# EAGLE design preprocessor (EAGLE 7.7.0)
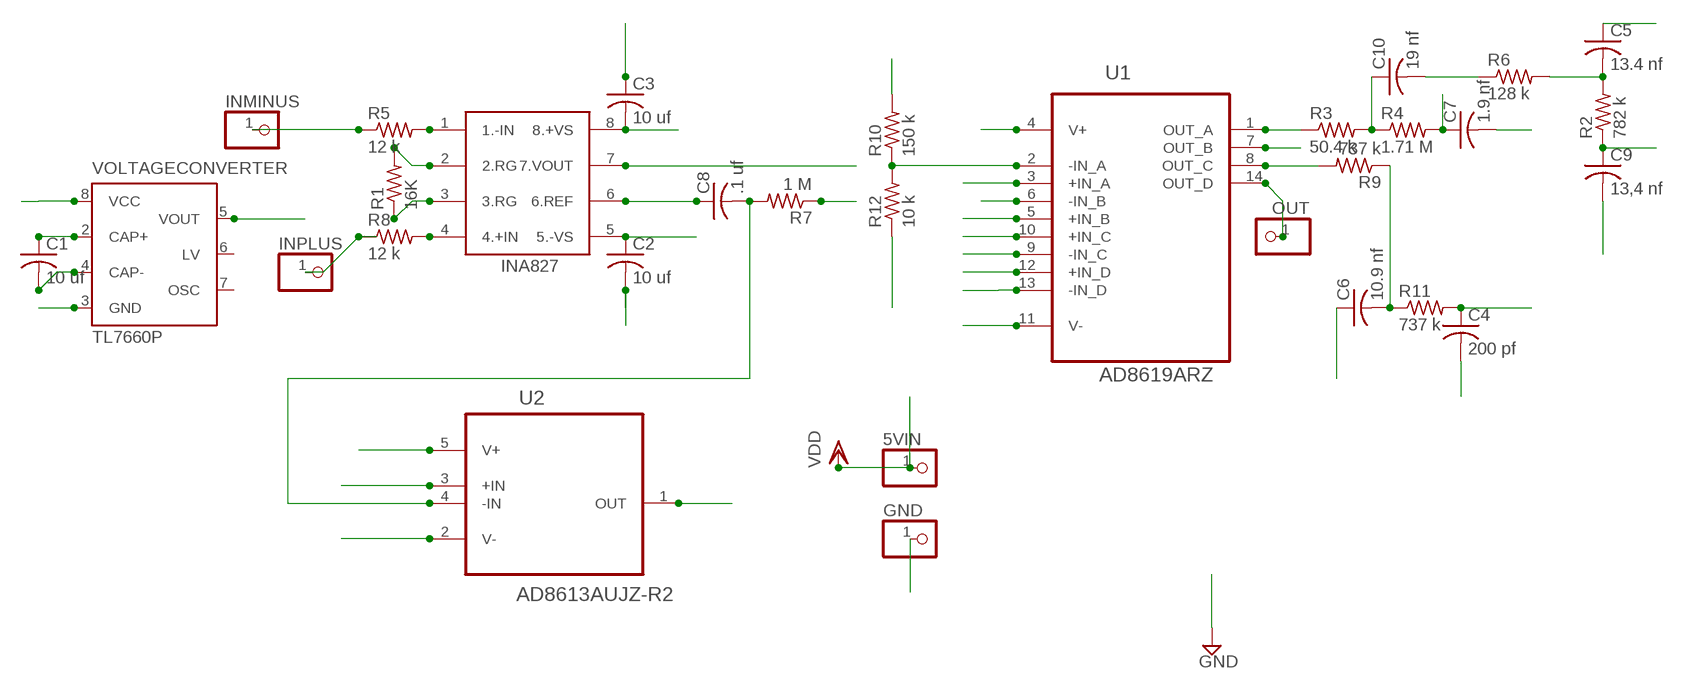
[diagram p0: schematic, sheet 1]

## Parts
5VIN  PINHD-1X1  [1X01]
C1  10 uf  C-US025-025X050  [C025-025X050]
C2  10 uf  C-US025-025X050  [C025-025X050]
C3  10 uf  C-US025-025X050  [C025-025X050]
C4  200 pf  C-US025-025X050  [C025-025X050]
C5  13.4 nf  C-US025-025X050  [C025-025X050]
C6  10.9 nf  C-US025-025X050  [C025-025X050]
C7  1.9 nf  C-US025-025X050  [C025-025X050]
C8  .1 uf  C-US025-025X050  [C025-025X050]
C9  13,4 nf  C-US025-025X050  [C025-025X050]
C10  19 nf  C-US025-025X050  [C025-025X050]
GND  PINHD-1X1  [1X01]
INAMP  INA827  [INA827]
INMINUS  PINHD-1X1  [1X01]
INPLUS  PINHD-1X1  [1X01]
OUT  PINHD-1X1  [1X01]
R1  16K  R-US_0207/7  [0207/7]
R2  782 k  R-US_0207/7  [0207/7]
R3  50.4 k  R-US_0207/7  [0207/7]
R4  1.71 M  R-US_0207/7  [0207/7]
R5  12 k  R-US_0207/7  [0207/7]
R6  128 k  R-US_0207/7  [0207/7]
R7  1 M  R-US_0207/7  [0207/7]
R8  12 k  R-US_0207/7  [0207/7]
R9  737 k  R-US_0207/7  [0207/7]
R10  150 k  R-US_0207/7  [0207/7]
R11  737 k  R-US_0207/7  [0207/7]
R12  10 k  R-US_0207/7  [0207/7]
U1  AD8619ARZ  [SOIC127P600X175-14N]
U2  AD8613AUJZ-R2  [SOT95P280X100-5N]
VOLTAGECONVERTER  TL7660P  [DIL08]

## Nets
GND: C2.2 C3.1 C4.2 C7.2 C9.2 GND.1 R12.1 U2.3(+IN) VOLTAGECONVERTER.3(GND)
I3: C9.1 R2.1 U1.10(+IN_C)
I4: C4.1 R11.2 U1.12(+IN_D)
I_P: INPLUS.1 R8.1
IAO: INAMP.7(7.VOUT) R7.1 U1.3(+IN_A)
IN2: C7.1 R4.2 U1.5(+IN_B)
N$1: C1.1 VOLTAGECONVERTER.2(CAP+)
N$2: C1.2 VOLTAGECONVERTER.4(CAP-)
N$3: INAMP.1(1.-IN) R5.2
N$4: INAMP.4(4.+IN) R8.2
N$5: INAMP.2(2.RG) R1.2
N$6: INAMP.3(3.RG) R1.1
N$7: C8.2 R7.2 U2.4(-IN)
N$8: R10.1 R12.2 U1.2(-IN_A)
N$9: C10.1 R3.2 R4.1
N$10: C5.2 R2.2 R6.2
N$11: C6.2 R9.1 R11.1
N$13: INMINUS.1 R5.1
O1: R3.1 R10.2 U1.1(OUT_A)
O2: C10.2 R6.1 U1.6(-IN_B) U1.7(OUT_B)
O3: C5.1 R9.2 U1.8(OUT_C) U1.9(-IN_C)
OUT: C6.1 OUT.1 U1.13(-IN_D) U1.14(OUT_D)
REF: C8.1 INAMP.6(6.REF) U2.1(OUT)
VDD: 5VIN.1 C3.2 INAMP.8(8.+VS) U1.4(V+) U2.5(V+) VOLTAGECONVERTER.8(VCC)
VDD-: C2.1 INAMP.5(5.-VS) U1.11(V-) U2.2(V-) VOLTAGECONVERTER.5(VOUT)
Unconnected: VOLTAGECONVERTER.6(LV) VOLTAGECONVERTER.7(OSC)

## Library data of the parts
5VIN GND INMINUS INPLUS OUT = adafruit:PINHD-1X1: Pin header 1x1 for 0.1" spacing With round pins
C1-C10 = rcl:C-US: CAPACITOR, American symbol
INAMP = INA827:INA827
R1-R12 = resistor:R-US_: RESISTOR, American symbol
U1 = ADI-Phase-2:AD8619ARZ: Operational Amplifiers; MPN: AD8619ARZ; OC_FARNELL: unknown; OC_NEWARK: 12M9134; PACKAGE: SOIC-14; SUPPLIER: Analog Devices
U2 = ADI-Phase-2:AD8613AUJZ-R2: Input/Output Operational Amplifiers; MPN: AD8613AUJZ-R2; OC_FARNELL: 1333262; OC_NEWARK: 12M9125; PACKAGE: TSOT-23-5; SUPPLIER: Analog Devices
VOLTAGECONVERTER = texas:TL7660: CMOS VOLTAGE CONVERTER Source: http://focus.ti.com/lit/ds/scas794/scas794.pdf; MPN: TL7660CP; OC_FARNELL: 1755283; OC_NEWARK: 14M2447

## Board
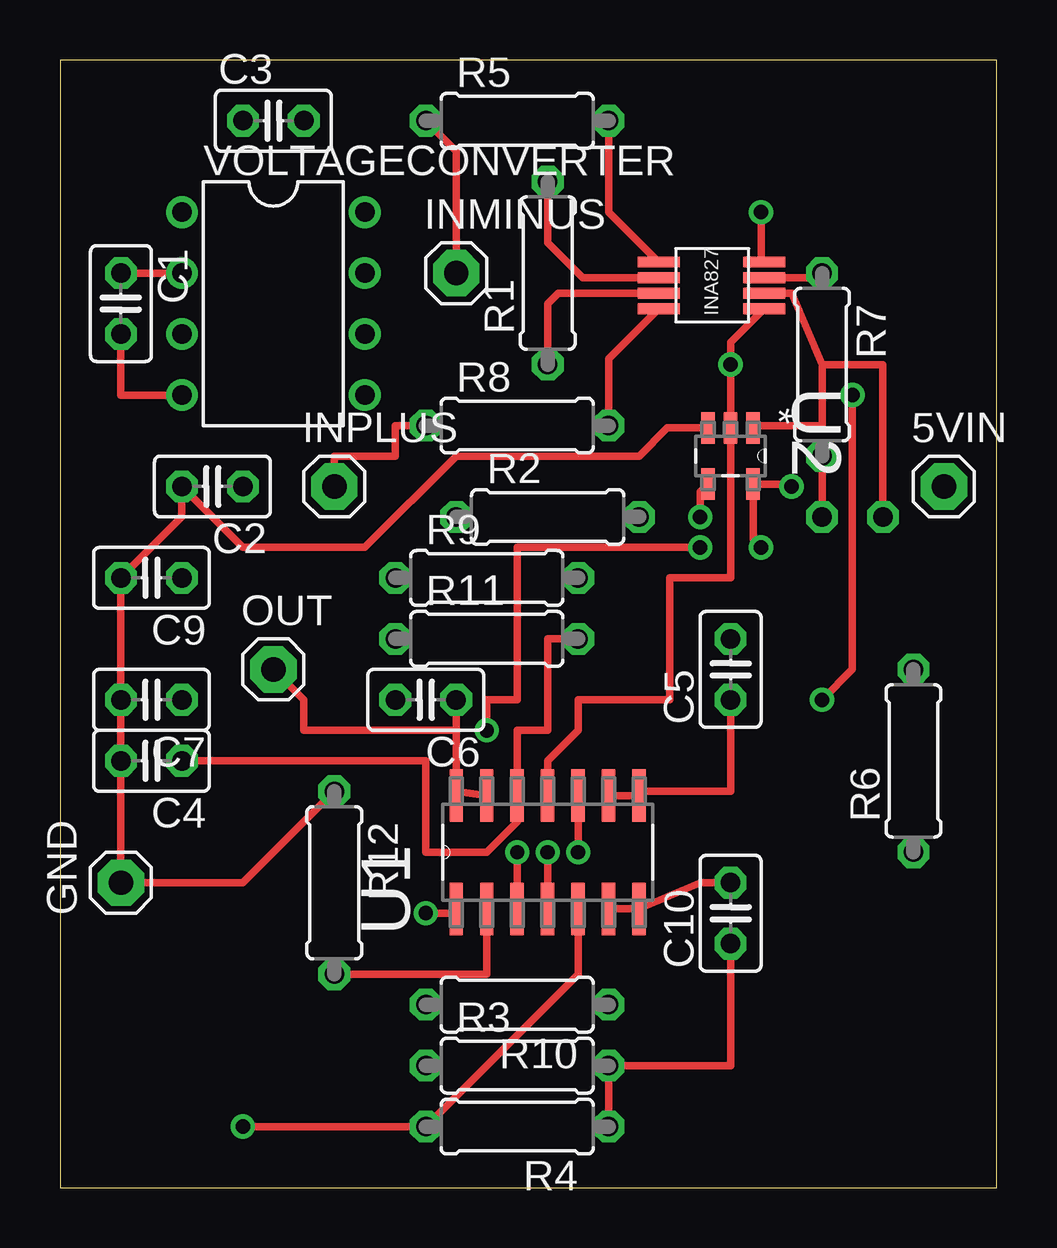
[diagram p1: board, top side]
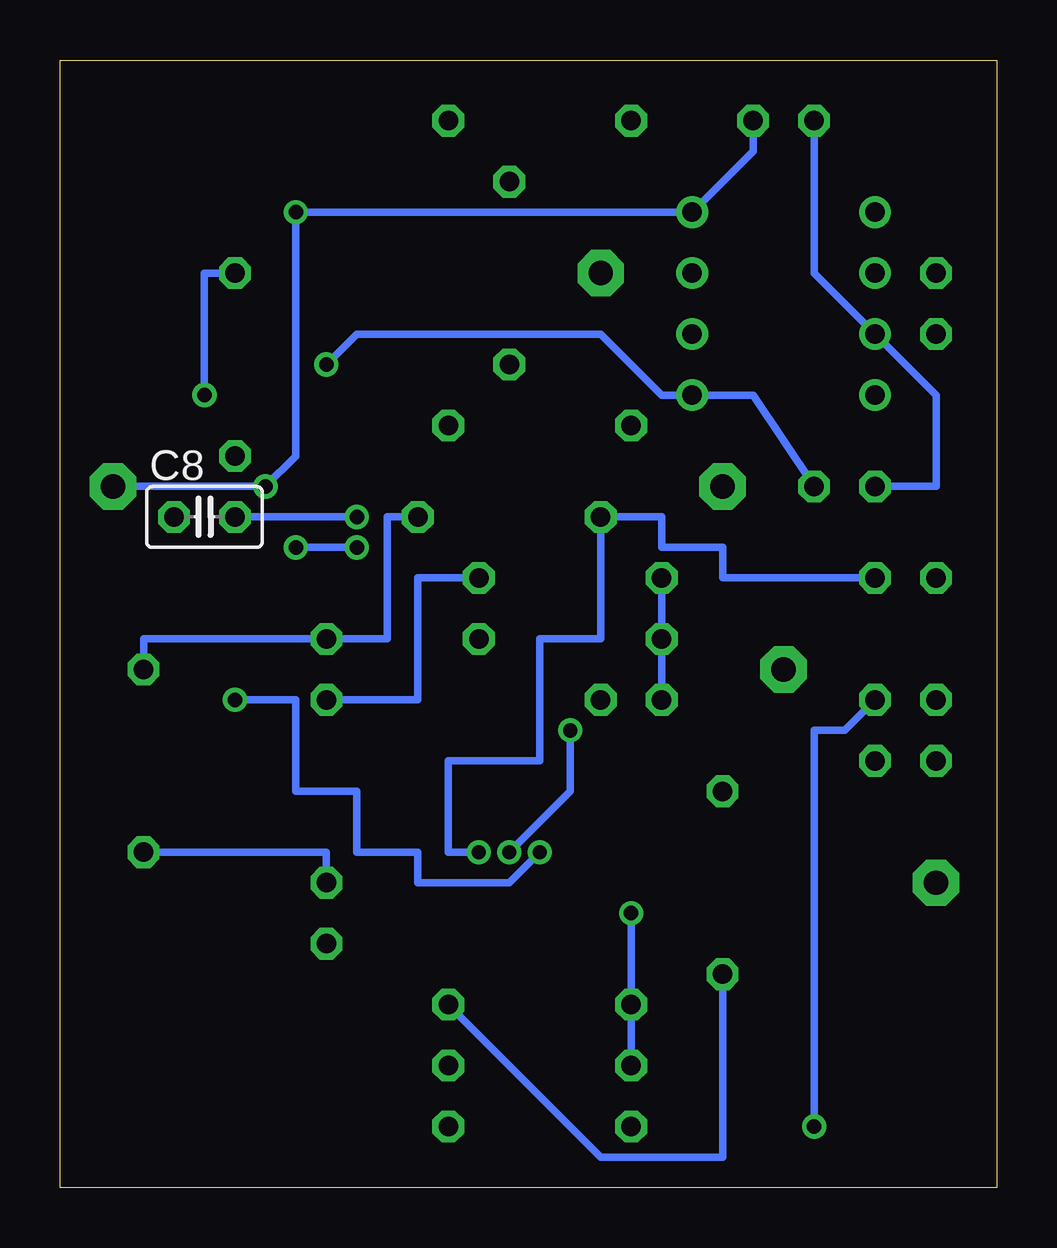
[diagram p2: board, bottom side, seen from below]

Size 39.04 x 46.98 mm. Coordinates in mm from the lower left corner, seen from the top.
Outline: 0,0 39.04,0 39.04,46.98 0,46.98 0,0
Copper layers (1*16): Top 0.035mm / dielectric 1.5mm / Bottom 0.035mm
Design rules "default": minimum track width 10mil, minimum drill 24mil, track to track 8mil, track to pad 8mil, pad to pad 8mil, via to via 8mil, smd to smd 8mil, copper to edge 40mil, drill to drill 8mil, minimum pad ring 10mil, minimum via ring 8mil, stop-mask expansion 4mil, vias tented up to drill 0mil, thermal gap 10mil

### Footprints (pad centres in the part's own frame; a part is rotated, then mirrored left to right if it is on the bottom)
1X01 = drill 1.016 pad 1.93 octagon: 1 0,0
C025-025X050 = drill 0.813 octagon: 1 -1.27,0; 2 1.27,0
INA827 = smd 1.75 x 0.45: 1 -3,3; 2 -3,2.35; 3 -3,1.7; 4 -3,1.05; 5 1.4,1.05; 6 1.4,1.7; 7 1.4,2.35; 8 1.4,3
0207/7 = drill 0.813 octagon: 1 -3.81,0; 2 3.81,0
SOIC127P600X175-14N = smd 2.184 x 0.559: 1 -2.362,3.81; 2 -2.362,2.54; 3 -2.362,1.27; 4 -2.362,0; 5 -2.362,-1.27; 6 -2.362,-2.54; 7 -2.362,-3.81; 8 2.362,-3.81; 9 2.362,-2.54; 10 2.362,-1.27; 11 2.362,0; 12 2.362,1.27; 13 2.362,2.54; 14 2.362,3.81
SOT95P280X100-5N = smd 1.321 x 0.559: 1 -1.168,0.94; 2 -1.168,0; 3 -1.168,-0.94; 4 1.168,-0.94; 5 1.168,0.94
DIL08 = drill 0.813 pad 1.27: 1 -3.81,-3.81; 2 -1.27,-3.81; 3 1.27,-3.81; 4 3.81,-3.81; 5 3.81,3.81; 6 1.27,3.81; 7 -1.27,3.81; 8 -3.81,3.81

### Placement (x,y rotation side)
5VIN  36.83,29.21 0 top
C1  2.54,36.83 270 top
C2  6.35,29.21 180 top
C3  8.89,44.45 0 top
C4  3.81,17.78 180 top
C5  27.94,21.59 90 top
C6  15.24,20.32 180 top
C7  3.81,20.32 180 top
C8  33.02,27.94 0 bottom
C9  3.81,25.4 180 top
C10  27.94,11.43 90 top
GND  2.54,12.7 90 top
INAMP  27.94,35.56 0 top
INMINUS  16.51,38.1 0 top
INPLUS  11.43,29.21 0 top
OUT  8.89,21.59 0 top
R1  20.32,38.1 90 top
R2  20.32,27.94 0 top
R3  19.05,5.08 0 top
R4  19.05,2.54 180 top
R5  19.05,44.45 0 top
R6  35.56,17.78 90 top
R7  31.75,34.29 270 top
R8  19.05,31.75 0 top
R9  17.78,25.4 0 top
R10  19.05,7.62 180 top
R11  17.78,22.86 0 top
R12  11.43,12.7 270 top
U1  20.32,13.97 90 top
U2  27.94,30.48 270 top
VOLTAGECONVERTER  8.89,36.83 270 top

### Tracks (layer width: path | path; a pad name or v marks a point on that pad's centre or on a via)
GND
  Top 0.305: U2.3 25.3,31.65 24.13,30.48 16.51,30.48 12.7,26.67 7.62,26.67 C2.2 5.08,27.94 C9.2 C7.2 C4.2 GND.1 7.62,12.7 R12.1
  Bottom 0.305: C3.1 7.62,38.1 VOLTAGECONVERTER.3 2.54,33.02 2.54,29.21 C2.2
I3  (via drill 0.6)
  Top 0.305: v21.59,13.97 U1.10
  Bottom 0.305: C9.1 11.43,25.4 11.43,26.67 13.97,26.67 13.97,27.94 R2.1 16.51,22.86 19.05,22.86 19.05,17.78 22.86,17.78 22.86,13.97 v21.59,13.97
I4
  Top 0.305: C4.1 15.24,17.78 15.24,13.97 17.78,13.97 19.05,15.24 U1.12 19.05,19.05 20.32,19.05 20.32,22.86 R11.2
I_P
  Top 0.305: R8.1 13.97,31.75 13.97,30.48 11.43,30.48 INPLUS.1
IAO  (via drill 0.6)
  Top 0.305: INAMP.7 31.75,37.91 R7.1 | 19.05,11.43 U1.3 v19.05,13.97 | v31.75,20.32 33.02,21.59 v33.02,33.02
  Bottom 0.305: v19.05,13.97 20.32,12.7 24.13,12.7 24.13,13.97 26.67,13.97 26.67,16.51 29.21,16.51 29.21,20.32 v31.75,20.32 | v33.02,33.02 33.02,38.1 R7.1
IN2  (via drill 0.6)
  Top 0.305: U1.5 21.59,8.89 R4.2 v7.62,2.54
  Bottom 0.305: C7.1 6.35,19.05 7.62,19.05 v7.62,2.54
N$1
  Top 0.305: VOLTAGECONVERTER.2 C1.1
N$2
  Top 0.305: C1.2 2.54,33.02 VOLTAGECONVERTER.4
N$3
  Top 0.305: R5.2 22.86,40.64 INAMP.1
N$4
  Top 0.305: R8.2 22.86,34.53 INAMP.4
N$5
  Top 0.305: INAMP.2 21.78,37.91 20.32,39.37 R1.2
N$6
  Top 0.305: INAMP.3 20.75,37.26 20.32,36.83 R1.1
N$7  (via drill 0.6)
  Top 0.305: C8.2 R7.2 | U2.4 26.67,28.98 v26.67,27.94
  Bottom 0.305: v26.67,27.94 C8.2
N$8
  Top 0.305: R12.2 17.78,8.89 U1.2
  Bottom 0.305: R10.1 16.51,1.27 11.43,1.27 R12.2
N$9
  Top 0.305: R4.1 R3.2 27.94,5.08 C10.1
N$10
  Bottom 0.305: R6.2 35.56,22.86 C5.2 25.4,22.86 25.4,27.94 R2.2
N$11
  Bottom 0.305: C6.2 R11.1 R9.1
N$13
  Top 0.305: INMINUS.1 16.51,43.18 R5.1
O1  (via drill 0.6)
  Top 0.305: v15.24,11.43 16.51,11.43 U1.1
  Bottom 0.305: R3.1 R10.2 v15.24,11.43
O2
  Top 0.305: C10.2 26.67,12.7 U1.7 U1.6
  Bottom 0.305: R6.1 27.94,13.97 C10.2
O3
  Top 0.305: U1.9 U1.8 24.31,16.51 27.94,16.51 C5.1
  Bottom 0.305: R9.2 24.13,25.4 24.13,20.32 C5.1
OUT
  Top 0.305: C6.1 16.51,19.05 | 16.51,19.05 16.51,17.78 16.51,16.51 | 16.51,16.51 U1.13 | OUT.1 10.16,20.32 10.16,19.05 16.51,19.05 | 16.51,16.51 U1.14
REF
  Top 0.305: INAMP.6 30.48,37.26 31.75,34.29 | 31.75,34.29 31.75,31.75 28.88,31.75 U2.1 | C8.1 34.29,34.29 31.75,34.29
VDD  (via drill 0.6)
  Top 0.305: v29.21,40.64 29.21,38.69 INAMP.8 | v30.48,29.21 30.38,29.31 U2.5 28.88,27 v29.21,26.67 | U1.4 v20.32,13.97 | v26.67,26.67 19.05,26.67 19.05,20.32 17.78,20.32 v17.78,19.05
  Bottom 0.305: C3.2 10.16,43.18 VOLTAGECONVERTER.8 v29.21,40.64 29.21,30.48 v30.48,29.21 5VIN.1 | v20.32,13.97 17.78,16.51 v17.78,19.05 | v26.67,26.67 v29.21,26.67
VDD-  (via drill 0.6)
  Top 0.305: INAMP.5 27.94,35.21 v27.94,34.29 U2.2 27.94,25.4 25.4,25.4 25.4,20.32 21.59,20.32 21.59,19.05 20.32,17.78 U1.11
  Bottom 0.305: C2.1 10.16,33.02 VOLTAGECONVERTER.5 13.97,33.02 16.51,35.56 26.67,35.56 v27.94,34.29